# Altium schematic sheet Inverter_Control.SchDoc
size A4; SheetNumber: 1; SheetTotal: 1
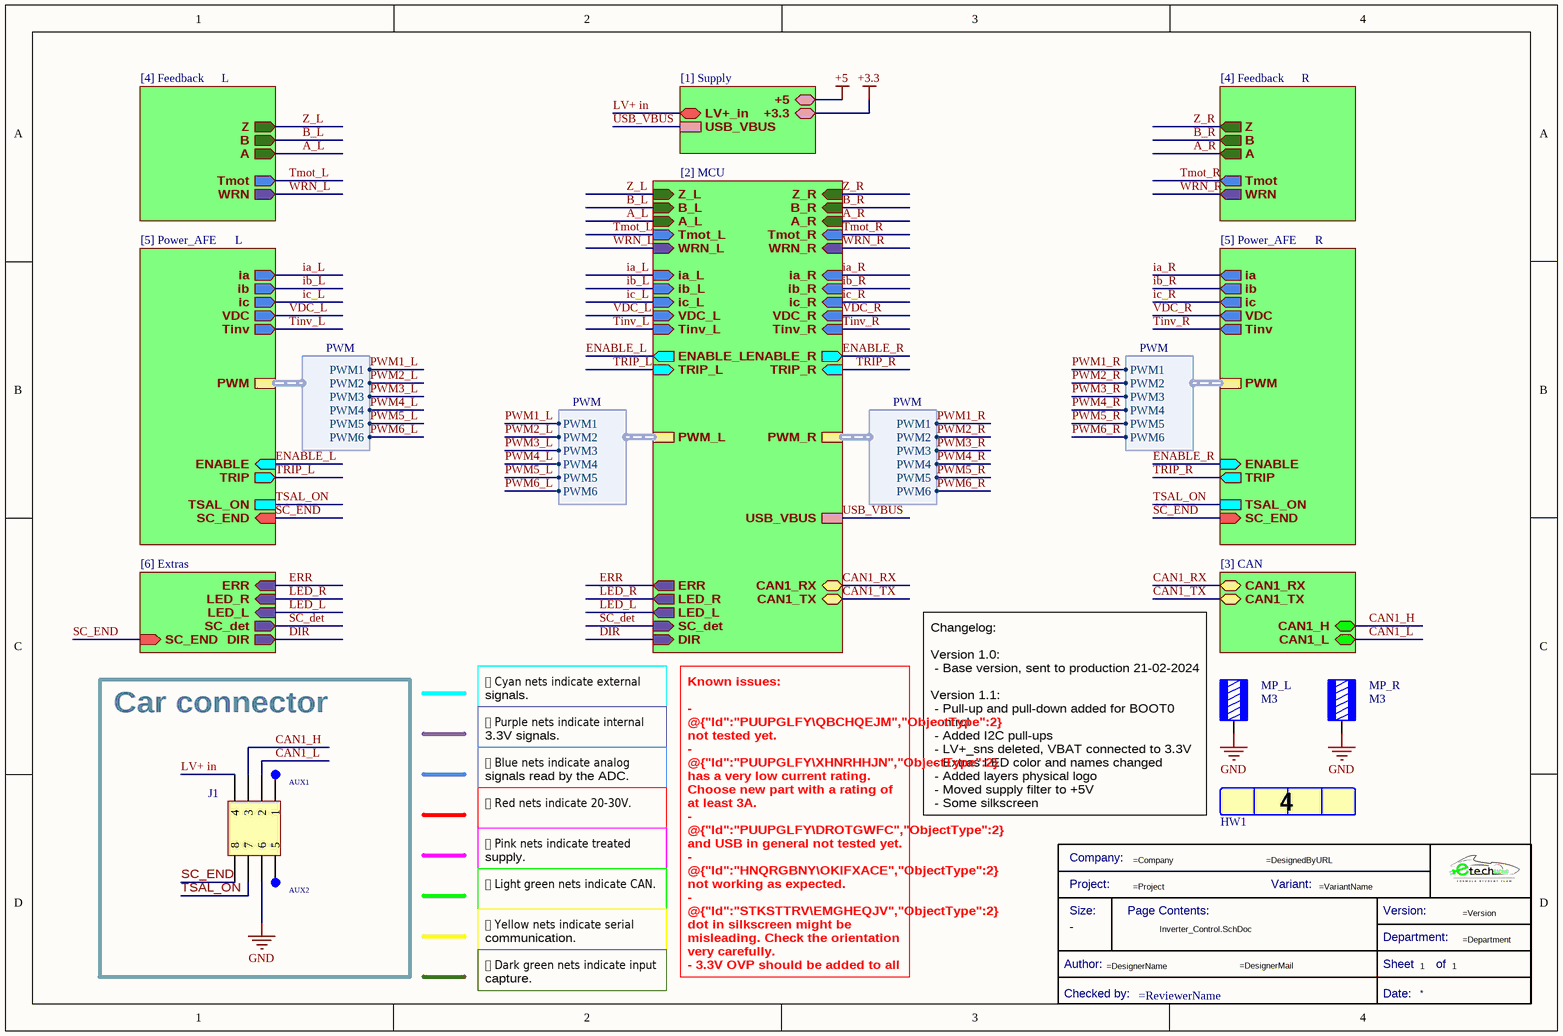
[diagram p0: Inverter_Control.SchDoc]

## Parts
*?  Title Block_template  (value not drawn)  (graphical)
AUX1  TestPoint  [TestPoint]  (value not drawn)  (no BOM)
AUX2  TestPoint  [TestPoint]  (value not drawn)  (no BOM)
HW1  LOGO CAPAS (4)  [LOGO_LAYERS_4]  (value not drawn)
J1  105310-1108  [J_NanoFit_2X4_V]  (value not drawn)
MP_L  M3  [7466313]
MP_R  M3  [7466313]

## Blocks framed on the sheet
Car connector: AUX1 AUX2 J1

## Sub-sheets
CAN = [3] CAN: CAN1_H (bidir), CAN1_L (bidir), CAN1_TX (bidir), CAN1_RX (bidir)
Extras = [6] Extras: LED_R (in), LED_L (in), DIR (out), ERR (in), SC_det (out), SC_END (in)
L = [4] Feedback: Tmot (out), WRN (out), A (out), B (out), Z (out)
L = [5] Power_AFE: TSAL_ON, SC_END (in), Tinv (out), ic (out), ib (out), ia (out), VDC (out), ENABLE (in), TRIP (out), PWM (harness PWM)
MCU = [2] MCU: Tinv_L (in), ic_L (in), ib_L (in), ia_L (in), VDC_L (in), ENABLE_L (out), TRIP_L (in), Tinv_R (in), ic_R (in), ib_R (in), ia_R (in), VDC_R (in), CAN1_RX (bidir), CAN1_TX (bidir), USB_VBUS, Tmot_L (in), WRN_L (in), Tmot_R (in), B_L (in), Z_L (in), A_R (in), B_R (in), Z_R (in), WRN_R (in), A_L (in), TRIP_R (in), PWM_L (harness PWM), PWM_R (harness PWM), LED_R (out), LED_L (out), DIR (in), ENABLE_R (out), ERR (out), SC_det (in)
R = [4] Feedback: Tmot (out), WRN (out), A (out), B (out), Z (out)
R = [5] Power_AFE: TSAL_ON, SC_END (in), Tinv (out), ic (out), ib (out), ia (out), VDC (out), ENABLE (in), TRIP (out), PWM (harness PWM)
Supply = [1] Supply: LV+_in (bidir), +5 (bidir), +3.3 (bidir), USB_VBUS

## Harnesses
PWM: PWM1, PWM2, PWM3, PWM4, PWM5, PWM6

## Nets
+3.3: sheet Supply/+3.3
+5: sheet Supply/+5
GND: J1.6 MP_L.1 MP_R.1
A_L: sheet MCU/A_L, sheet L/A
A_R: sheet MCU/A_R, sheet R/A
B_L: sheet MCU/B_L, sheet L/B
B_R: sheet MCU/B_R, sheet R/B
CAN1_H: J1.3 ; sheet CAN/CAN1_H
CAN1_L: J1.2 ; sheet CAN/CAN1_L
CAN1_RX: sheet MCU/CAN1_RX, sheet CAN/CAN1_RX
CAN1_TX: sheet MCU/CAN1_TX, sheet CAN/CAN1_TX
DIR: sheet MCU/DIR, sheet Extras/DIR
ENABLE_L: sheet MCU/ENABLE_L, sheet L/ENABLE
ENABLE_R: sheet MCU/ENABLE_R, sheet R/ENABLE
ERR: sheet MCU/ERR, sheet Extras/ERR
ia_L: sheet MCU/ia_L, sheet L/ia
ia_R: sheet MCU/ia_R, sheet R/ia
ib_L: sheet MCU/ib_L, sheet L/ib
ib_R: sheet MCU/ib_R, sheet R/ib
ic_L: sheet MCU/ic_L, sheet L/ic
ic_R: sheet MCU/ic_R, sheet R/ic
LED_L: sheet MCU/LED_L, sheet Extras/LED_L
LED_R: sheet MCU/LED_R, sheet Extras/LED_R
LV+ in: J1.4 ; sheet Supply/LV+_in
PWM1_L: sheet MCU/PWM_L.PWM1, sheet L/PWM.PWM1
PWM1_R: sheet R/PWM.PWM1, sheet MCU/PWM_R.PWM1
PWM2_L: sheet MCU/PWM_L.PWM2, sheet L/PWM.PWM2
PWM2_R: sheet R/PWM.PWM2, sheet MCU/PWM_R.PWM2
PWM3_L: sheet MCU/PWM_L.PWM3, sheet L/PWM.PWM3
PWM3_R: sheet R/PWM.PWM3, sheet MCU/PWM_R.PWM3
PWM4_L: sheet MCU/PWM_L.PWM4, sheet L/PWM.PWM4
PWM4_R: sheet R/PWM.PWM4, sheet MCU/PWM_R.PWM4
PWM5_L: sheet MCU/PWM_L.PWM5, sheet L/PWM.PWM5
PWM5_R: sheet R/PWM.PWM5, sheet MCU/PWM_R.PWM5
PWM6_L: sheet MCU/PWM_L.PWM6, sheet L/PWM.PWM6
PWM6_R: sheet R/PWM.PWM6, sheet MCU/PWM_R.PWM6
SC_det: sheet MCU/SC_det, sheet Extras/SC_det
SC_END: J1.8 ; sheet L/SC_END, sheet Extras/SC_END, sheet R/SC_END
Tinv_L: sheet MCU/Tinv_L, sheet L/Tinv
Tinv_R: sheet MCU/Tinv_R, sheet R/Tinv
Tmot_L: sheet MCU/Tmot_L, sheet L/Tmot
Tmot_R: sheet MCU/Tmot_R, sheet R/Tmot
TRIP_L: sheet MCU/TRIP_L, sheet L/TRIP
TRIP_R: sheet MCU/TRIP_R, sheet R/TRIP
TSAL_ON: J1.7 ; sheet L/TSAL_ON, sheet R/TSAL_ON
USB_VBUS: sheet MCU/USB_VBUS, sheet Supply/USB_VBUS
VDC_L: sheet MCU/VDC_L, sheet L/VDC
VDC_R: sheet MCU/VDC_R, sheet R/VDC
WRN_L: sheet MCU/WRN_L, sheet L/WRN
WRN_R: sheet MCU/WRN_R, sheet R/WRN
Z_L: sheet MCU/Z_L, sheet L/Z
Z_R: sheet MCU/Z_R, sheet R/Z
NetAUX1_1: AUX1.1(TP) J1.1
NetAUX2_1: AUX2.1(TP) J1.5

## Notes on the sheet
- ⓘ Cyan nets indicate external signals.
- ⓘ Purple nets indicate internal 3.3V signals.
- ⓘ Blue nets indicate analog signals read by the ADC.
- ⓘ Red nets indicate 20-30V.
- (near MP_L) Changelog:
  Version 1.0:
  - Base version, sent to production 21-02-2024
  Version 1.1:
  - Pull-up and pull-down added for BOOT0 control
  - Added I2C pull-ups
  - LV+_sns deleted, VBAT connected to 3.3V
  - Extras LED color and names changed
  - Added layers physical logo
  - Moved supply filter to +5V
  - Some silkscreen
- ⓘ Pink nets indicate treated supply.
- ⓘ Light green nets indicate CAN.
- ⓘ Yellow nets indicate serial communication.
- ⓘ Dark green nets indicate input capture.
- Known issues:
  - @{"Id":"PUUPGLFY\QBCHQEJM","ObjectType":2} not tested yet.
  - @{"Id":"PUUPGLFY\XHNRHHJN","ObjectType":2} has a very low current rating. Choose new part with a rating of at least 3A.
  - @{"Id":"PUUPGLFY\DROTGWFC","ObjectType":2} and USB in general not tested yet.
  - @{"Id":"HNQRGBNY\OKIFXACE","ObjectType":2} not working as expected.
  - @{"Id":"STKSTTRV\EMGHEQJV","ObjectType":2} dot in silkscreen might be misleading. Check the orientation very carefully.
  - 3.3V OVP should be added to all non-5V-tolerant MCU pins.
  - Most if not all 15R resistors could very well be 0R or solder bridges.
  - 10uF 50V 0805 caps are expensive and should be replaced with 10uF 50V 1206 or 10uF 50V 1210.
- (in symbol LOGO CAPAS) 4 Layers
- (in symbol Title Block_template) Company:; Project:; Variant:; Size:; Page Contents:; Version:; Department:; Author:; Sheet; of; Checked by:; Date:

## Library data of the parts
*? = Title Block_template: Standard Title Block; .Creator: GP; Category: Title Block; .PCBcheck: GP; .SCHcheck: GP; Checked by:: =ReviewerName; Size: -
AUX1 AUX2 = TestPoint: Test Point 1x1 mm; .Creator: GP; Category: TestPoint; .PCBcheck: GP; .SCHcheck: GP
HW1 = LOGO CAPAS: Logo 4 capas; Id: 0074; Observations: Layers; Checked: False; Type: Logos; Supplier 1: Farnell; Supplier 2: Mouser; Supplier 3: RS; Supplier 4: Digi-Key; Author: Enric; Date: 22/06/2012
J1 = J_NanoFit_2x4_V: Nano-Fit Conn Power HDR 8 POS 2.5mm Solder ST Thru-Hole 8 Terminal 1 Port Nano-Fit™ Frame; Manufacturer: Molex; Supplier 1: RSComponents; Manufacturer Part Number: 105310-1108; RoHS: No; Category: Headers and Wire Housings; Stock 1: 1512; Pricing 1: 8=1,52500, 40=0,87900, 80=0,83600 (GBP); ComponentLink1URL: https://www.molex.com/pdm_docs/sd/1053101108_sd.pdf; ComponentLink1Description: Datasheet; ComponentLink2URL: https://www.molex.com/pdm_docs/ps/PS-105300-100-001.pdf?src-supplier=Digi-Key; ComponentLink2Description: https://www.molex.com/pdm_docs/ps/PS-105300-100-001.pdf?src-supplier=Digi-Key; ComponentLink3URL: http://www.farnell.com/datasheets/2551089.pdf?src-supplier=Newark; ComponentLink3Description: http://www.farnell.com/datasheets/2551089.pdf?src-supplier=Newark; Supplier Part Number 1: 1623685; ComponentLink4Description: Where buy it; ComponentLink4URL: https://www.molex.com/molex/products/part-detail/pcb_headers/1053101108
MP_L MP_R = 7466313: WP-SMRA REDCUBE SMT Right Angled with pins, M3, 50A; Manufacturer: Wurth Elektronik; Surface: Tin; ComponentLink1Description: Website Link; ComponentLink1URL: https://www.we-online.com/redexpert/article/7466313?ad; ComponentLink2Description: Datasheet Link; ComponentLink2URL: https://www.we-online.com/redexpert/spec/7466313?ad; Manufacturer Part Number: 7466313; Category: REDCUBE SMT; Match Code: WP-SMRA; Mount: Surface Mount; Operating Temperature Max: 150°C; Operating Temperature Min: -55°C; Packaging: Bulk; Height: 7mm; Material: Brass; Rated Current: 50A; Thread Size: M3